# Altium schematic sheet Sheet1.SchDoc
size A4
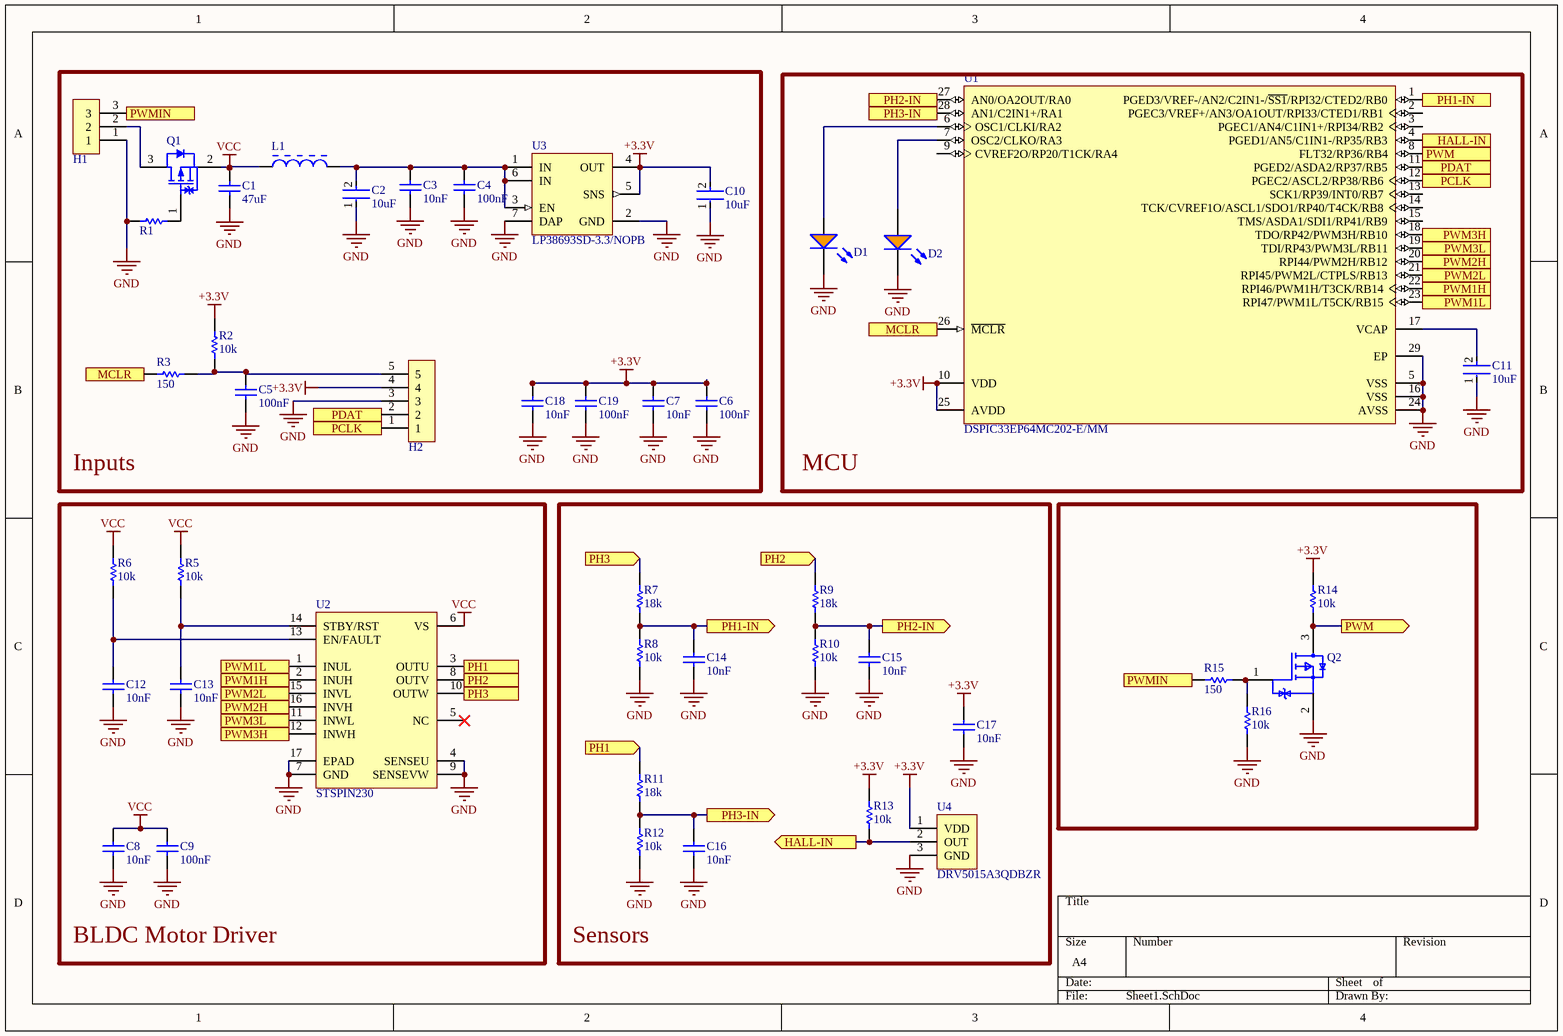
[diagram p0: Sheet1.SchDoc]

## Parts
C1  47uF  [TAYO-C1210-2_L]
C2  10uF  [FP-CL21B106KOQNNNE-MFG]
C3  10nF  [CAPC1005X56X25ML10T15]
C4  100nF  [CAPC1005X56X25ML10T15]
C5  100nF  [CAPC1005X56X25ML10T15]
C6  100nF  [CAPC1005X56X25ML10T15]
C7  10nF  [CAPC1005X56X25ML10T15]
C8  10nF  [CAPC1005X56X25ML10T15]
C9  100nF  [CAPC1005X56X25ML10T15]
C10  10uF  [FP-CL21B106KOQNNNE-MFG]
C11  10uF  [FP-CL21B106KOQNNNE-MFG]
C12  10nF  [CAPC1005X56X25ML10T15]
C13  10nF  [CAPC1005X56X25ML10T15]
C14  10nF  [CAPC1005X56X25ML10T15]
C15  10nF  [CAPC1005X56X25ML10T15]
C16  10nF  [CAPC1005X56X25ML10T15]
C17  10nF  [CAPC1005X56X25ML10T15]
C18  10nF  [CAPC1005X56X25ML10T15]
C19  100nF  [CAPC1005X56X25ML10T15]
D1  HSMD-C190  [AVAG-HSMX-C190_V]  (value not drawn)
D2  HSMD-C190  [AVAG-HSMX-C190_V]  (value not drawn)
H1  H3P2.54  [H3P2.54]  (value not drawn)
H2  H5P2.54  [H5P2.54*]  (value not drawn)
L1  BLM18AG331SN1D  [MURA-BLM18-RF-H4-CHIP-2_V]  (value not drawn)
Q1  BSS308PE  [INF-PG-SOT23_L]  (value not drawn)
Q2  DMG1013T-7  [FP-SOT523-IPC_B]  (value not drawn)
R1  RC0402FR-07150RL  [RESC1005X40X25ML05T10]  (value not drawn)
R2  10k  [RESC1005X40X25ML5T10]
R3  150  [RESC1005X40X25ML05T10]
R5  10k  [RESC1005X40X25ML5T10]
R6  10k  [RESC1005X40X25ML5T10]
R7  18k  [RESC1005X40X25ML05T10]
R8  10k  [RESC1005X40X25ML5T10]
R9  18k  [RESC1005X40X25ML05T10]
R10  10k  [RESC1005X40X25ML5T10]
R11  18k  [RESC1005X40X25ML05T10]
R12  10k  [RESC1005X40X25ML5T10]
R13  10k  [RESC1005X40X25ML5T10]
R14  10k  [RESC1005X40X25ML5T10]
R15  150  [RESC1005X40X25ML05T10]
R16  10k  [RESC1005X40X25ML5T10]
U1  DSPIC33EP64MC202-E/MM  [MCHP-QFN-S-MM28_N]
U2  STSPIN230  [QFN50P300X300X100_HS-17N]
U3  LP38693SD-3.3/NOPB  [NGG0006A_V]
U4  DRV5015A3QDBZR  [SOT95P237X95-3N]

## Blocks framed on the sheet
Inputs: C1-C7 C10 C18 C19 H1 H2 L1 Q1 R1-R3 U3
MCU: C11 D1 D2 U1
BLDC Motor Driver: C8 C9 C12 C13 R5 R6 U2
Sensors: C14-C17 R7-R13 U4

## Ports
HALL-IN (in), HALL-IN (out), MCLR (in), MCLR (out), PCLK (out), PDAT (out), PH1 (in), PH1 (out), PH1-IN (in), PH1-IN (out), PH2 (in), PH2 (out), PH2-IN (in), PH2-IN (out), PH3 (in), PH3 (out), PH3-IN (in), PH3-IN (out), PWM1H (in), PWM1H (out), PWM1L (in), PWM1L (out), PWM2H (in), PWM2H (out), PWM2L (in), PWM2L (out), PWM3H (in), PWM3H (out), PWM3L (in), PWM3L (out), PWM (in), PWM (out), PWMIN (out)

## Nets
+3.3V: C6.2 C7.2 C10.2 C17.2 C18.2 C19.2 H2.4 R2.2 R13.2 R14.1 U1.10(VDD) U1.25(AVDD) U3.4(OUT) U3.5(SNS) U4.1(VDD)
GND: C1.1 C2.1 C3.1 C4.1 C5.1 C6.1 C7.1 C8.1 C9.1 C10.1 C11.1 C12.1 C13.1 C14.1 C15.1 C16.1 C17.1 C18.1 C19.1 D1.2(K) D2.2(K) H1.1 H2.3 Q2.2(S) R1.2 R8.1 R10.1 R12.1 R16.1 U1.5(VSS) U1.16(VSS) U1.24(AVSS) U1.29(EP) U2.4(SENSEU) U2.7(GND) U2.9(SENSEVW) U2.17(EPAD) U3.2(GND) U3.7(DAP) U4.3(GND)
VCC: C1.2 C8.2 C9.2 L1.1 Q1.2(SOURCE) R5.2 R6.2 U2.6(VS)
HALL-IN: R13.1 U1.4(PGED1/AN5/C1IN1-/RP35/RB3) U4.2(OUT) ; port HALL-IN
MCLR: R3.1 U1.26(~{MCLR}) ; port MCLR
PCLK: H2.1 U1.12(PGEC2/ASCL2/RP38/RB6) ; port PCLK
PDAT: H2.2 U1.11(PGED2/ASDA2/RP37/RB5) ; port PDAT
PH1: R11.2 U2.3(OUTU) ; port PH1
PH1-IN: C14.2 R7.1 R8.2 U1.1(PGED3/VREF-/AN2/C2IN1-/~{SS1}/RPI32/CTED2/RB0) ; port PH1-IN
PH2: R9.2 U2.8(OUTV) ; port PH2
PH2-IN: C15.2 R9.1 R10.2 U1.27(AN0/OA2OUT/RA0) ; port PH2-IN
PH3: R7.2 U2.10(OUTW) ; port PH3
PH3-IN: C16.2 R11.1 R12.2 U1.28(AN1/C2IN1+/RA1) ; port PH3-IN
PWM: Q2.3(D) R14.2 U1.8(FLT32/RP36/RB4) ; port PWM
PWM1H: U1.22(RPI46/PWM1H/T3CK/RB14) U2.2(INUH) ; port PWM1H
PWM1L: U1.23(RPI47/PWM1L/T5CK/RB15) U2.1(INUL) ; port PWM1L
PWM2H: U1.20(RPI44/PWM2H/RB12) U2.16(INVH) ; port PWM2H
PWM2L: U1.21(RPI45/PWM2L/CTPLS/RB13) U2.15(INVL) ; port PWM2L
PWM3H: U1.18(TDO/RP42/PWM3H/RB10) U2.12(INWH) ; port PWM3H
PWM3L: U1.19(TDI/RP43/PWM3L/RB11) U2.11(INWL) ; port PWM3L
PWMIN: H1.3 R15.1 ; port PWMIN
NetC2_2: C2.2 C3.2 C4.2 L1.2 U3.1(IN) U3.3(EN) U3.6(IN)
NetC5_2: C5.2 H2.5 R2.1 R3.2
NetC11_2: C11.2 U1.17(VCAP)
NetC12_2: C12.2 R6.1 U2.13(EN/FAULT)
NetC13_2: C13.2 R5.1 U2.14(STBY/RST)
NetD1_1: D1.1(A) U1.6(OSC1/CLKI/RA2)
NetD2_1: D2.1(A) U1.7(OSC2/CLKO/RA3)
NetH1_2: H1.2 Q1.3(DRAIN)
NetQ1_1: Q1.1(GATE) R1.1
NetQ2_1: Q2.1(G) R15.2 R16.2

Not connected (* = marked no-connect by the designer): U1 2(PGEC3/VREF+/AN3/OA1OUT/RPI33/CTED1/RB1) 3(PGEC1/AN4/C1IN1+/RPI34/RB2) 9(CVREF2O/RP20/T1CK/RA4) 13(SCK1/RP39/INT0/RB7) 14(TCK/CVREF1O/ASCL1/SDO1/RP40/T4CK/RB8) 15(TMS/ASDA1/SDI1/RP41/RB9); U2 5(NC)*

## Library data of the parts
C1 = CMP-2000-06559-1: High Value Multilayer Ceramic Capacitor, 47 uF, 10 V, +/- 20%, -55 to 125 degC, 2-Pin - LMK325B7476KM-PRSMD (C1210), RoHS, Tape and Reel; Manufacturer: Taiyo Yuden; Capacitance: 47µF; Voltage - Rated: 10V; Other Names: 587-2783-6; Online Catalog: MSeries; Temperature Coefficient: X7R; Applications: GeneralPurpose; Lead Spacing: -; Mounting Technology: SurfaceMount; Height - Seated (Max): -; Thickness (Max): 0.106"(2.70mm); Mounting Type: SurfaceMount,MLCC; Package / Case: 1210(3225Metric); Lead Style: -; Manufacturer URL: http://www.t-yuden.com/; Size / Dimension: 0.126"Lx0.098"W(3.20mmx2.50mm); Datasheet Version: 10/2014; Packaging: Digi-Reel®; Category: Capacitors; Datasheet URL: https://datasheet.ciiva.com/142/lmk325b7476mm-tr-ss-142765.pdf; Tolerance: ±20%; Features: -; Package Reference: C1210; Package Description: 2-Pin Surface Mount Device, Body 3.2 x 2.5 mm, Height 2.7 mm; Series: M; Family: CeramicCapacitors; Operating Temperature: -55°C~125°C; Standard Package: 1; Ratings: -
C2 C10 C11 = CMP-2000-06106-2: CAP CER 10UF 16V X7R 0805 - CL21B106KOQNNNE; Manufacturer: Samsung Electro-Mechanics America, Inc; Material: Ceramic; Tolerance: 10%; Temperature Coefficient: 15%; Digikey Description: CAP CER 10UF 16V X7R 0805; Lead Free: Yes; ComponentLink2URL: http://www.samsungsem.com/servlet/FileDownload?path=productsearch&sname=CL21B106KOQNNNE.pdf&oname=CL21B106KOQNNNE.pdf; ComponentLink2Description: Datasheet; Temperature Range Low: -55°C; RoHS: TRUE; Category: Cap; Temperature Characteristic: X7R; Manufacturer Part Number: CL21B106KOQNNNE; Automotive: No; Octopart: https://octopart.com/cl21b106koqnnne-samsung-19832289; Device Class L3: Ceramic Capacitors; Temperature Range High: +125°C; Height: 1.4mm; Device Class L2: Capacitors; Voltage Rating: 16V; Value: 10uF; Temperature: -55°C to +125°C; Device Class L1: Passive Components; Ipc Land Pattern Name: CAPC200125X125; Package: CL21B106KOQNNNE; Capacitance: 10uF
C3 C7 C8 C12-C18 = CMP-2008-02799-1: 0402YC103MAT2A; Manufacturer: AVX Interconnect / Elco; Part Number: 0402YC103MAT2A
C4 C5 C9 = CMP-2008-02800-1: 0402YC104KAT2A; Manufacturer: AVX Interconnect / Elco; Part Number: 0402YC104KAT2A
C6 C19 = CMP-2008-02800-1: 100nF / 0402YC104KAT2A; Manufacturer: AVX Interconnect / Elco; Part Number: 0402YC104KAT2A
D1 D2 = CMP-007-00012-1: LED Uni-Color Orange, 52 mW, 20 mA, -40 to 85 degC, 2-Pin SMD, RoHS, Tape and Reel; Manufacturer: Avago; Luminous Intensity: 8mcd; Power: 52mW; Nominal Vf: 2.2V; Viewing Angle: 170degrees; Forward Current: 20mA; Lens Style: Diffused; Packaging: TapeandReel; Package Reference: HSMX-C190; Package Quantity: 4000; Colour: Orange; Datasheet URL: http://docs.avagotech.com/docs/AV02-0551EN; Pins: 2; Package Description: 2-Pin Surface Mount Device, Body 1.6 x 0.8 mm, Height 0.9 mm; Datasheet Version: Mar-12; RoHS Compliant: True; Min Operating Temperature: -40°C; Case/Package: 0603; Manufacturer URL: http://www.avagotech.com/; Max Operating Temperature: 85°C; Mounting Technology: SM; Illumination Colour: Orange; Forward Voltage: 2.2V
L1 = CMP-0686-00430-2: Chip Ferrite Bead for General Use, 330 Ohm, 500 mA, -55 to 125 degC, 1.6 x 0.8 x 0.95 mm SMD, Tape and Reel; Manufacturer: Murata; Impedance (at 100 MHz): 330 Ohm +/- 25%; Rated Current: 500 mA; DC Resistance: 0.30 Ohm Max.; PartNumber: BLM18AG331SN1D; ComponentLink3Description: Package Specification; PackageReference: BLM18_H950-2; DatasheetVersion: 08/2013; ComponentLink1URL: http://www.murata.com/; ComponentLink2Description: Datasheet; Mounting Technology: Surface Mount; Operating Temperature Range: -55 to 125 degC; Packing: Tape and Reel; ComponentLink1Description: Manufacturer URL; ComponentLink3URL: http://www.murata.com/products/catalog/pdf/c31e.pdf; PackageDescription: 2-Pin Chip, Body 1.6 x 0.8 mm; ComponentLink2URL: http://www.murata.com/products/catalog/pdf/c31e.pdf
Q1 = CMP-1099-00030-1: P-Channel OptiMOS P3 Small-Signal-Transistor, -30 V VDS, -2 A ID, -55 to 150 degC, PG-SOT23, Reel, Green; Manufacturer: Infineon; RDS (on) (max) (@4.5V): 130Â mOhm; Pto t (max): 0.5Â W; ID (max): -2Â A; IDpuls (max): -8Â A; VDS (max): -30Â V; VGS(th) (min): -2Â V; Green: TRUE; RDS (on) (max): 80Â mOhm; QG: -5Â nC; Rth: 250Â K/W; VGS(th) (max): -1Â V; PartNumber: BSS308PE; ComponentLink3Description: Package Specification; PackageDescription: 3-Pin Small Outline Transistor Package, 2.9 x 1.3 mm Body, 0.95 mm Pitch; Mounting Technology: Surface Mount; Packing: Reel; PackageReference: PG-SOT23; PackageVersion: Apr-08; Halogen-free: TRUE; DatasheetVersion: Rev. 2.03; ComponentLink2URL: http://www.infineon.com/dgdl/BSS308PE_Rev23_.pdf?folderId=db3a304314dca38901154a72e3951a65&fileId=db3a304330f686060131099c80400073; ComponentLink2Description: Datasheet; ComponentLink1Description: Manufacturer URL; ComponentLink1URL: http://www.infineon.com/; ComponentLink3URL: http://www.infineon.com/dgdl/SOT23-Package_Overview.pdf?folderId=db3a30431936bc4b0119532290053c66&fileId=db3a30431936bc4b0119533468123c85
Q2 = CMP-12801-000011-2: MOSFET P-CH 20V 0.46A SOT-523; Threshold Voltage: -1V; Continuous Drain Current (ID): 460mA; Rise Time: 8.1ns; Turn-Off Delay Time: 28.4ns; Number of Channels: 1; On-State Resistance: 700mR; Power Dissipation: 270mW; Input Capacitance: 59.76pF; Fall Time: 20.7ns; Turn-On Delay Time: 5.1ns; Drain to Source Resistance: 1R; Drain to Source Breakdown Voltage: -20V; Gate to Source Voltage (Vgs): 6V; Element Configuration: Single; Min Operating Temperature: -55°C; Max Operating Temperature: 150°C; Case/Package: SOT-523; Lead Free: Lead Free; Length: 1.7mm; REACH SVHC: No SVHC; Radiation Hardening: No; Number of Pins: 3; Weight: 7.1E-05oz; Rds On Max: 700mR; Height: 0.8mm; Number of Elements: 1; Packaging: Tape and Reel; Mount: Surface Mount; Width: 0.85mm; Drain to Source Voltage (Vdss): 20V; Max Power Dissipation: 270mW; Contact Plating: Tin; Package Quantity: 1
R1 = CMP-2002-07401-1: Manufacturer: Yageo / Phycomp; Part Number: RC0402FR-07150RL
R2 R5 R6 R8 R10 R12-R14 R16 = CMP-2002-07915-2: Chip Resistor, 10 KOhm, +/- 5%, 0.063 W, -55 to 155 degC, 0402 (1005 Metric), RoHS, Tape and Reel - RC0402JR-0710KL; Resistance: 10 kohm; Voltage Rating (DC): 50 V; Power Rating: 63 mW; Case\Package: 0402; RoHSCompliant: true; DatasheetVersion: Rev. 4, 02/2016; ComponentLink1Description: Manufacturer URL; PackageDescription: 2-Pin Surface Mount Device, Body 1 x 0.5 mm; Case Code (Imperial): 0402; PackageReference: 0402; ComponentLink1URL: http://www.yageo.com/; Mounting Technology: Surface Mount; REACH SVHC: No SVHC; ComponentLink2Description: Datasheet; Case Code (Metric): 1005; Width: 0.5 mm; Package Quantity: 10000; Packaging: Tape and Reel; Max Operating Temperature: 155 degC; Mount: Surface Mount; Length: 1 mm; ComponentLink2URL: http://www.yageo.com/documents/recent/PYu-RC_Group_51_RoHS_L_04.pdf; Tolerance: 5%; Height: 0.35 mm; Voltage Rating: 50 V; Pins: 2; Min Operating Temperature: -55 degC
R3 R15 = CMP-2002-07401-1: RC0402FR-07150RL; Manufacturer: Yageo / Phycomp; Part Number: RC0402FR-07150RL
R7 R9 R11 = CMP-2002-07934-1: RC0402JR-0718KL; Manufacturer: Yageo / Phycomp; Part Number: RC0402JR-0718KL
U1 = CMP-0375-00039-1: 16-Bit Microcontroller and Digital Signal Controller with High-Speed PWM, Op Amps and Advanced Analog, 70 MIPS, 21 I/O, GPIO, -40 to 125 degC, 28-pin QFN (MM28), Tube; Manufacturer: Microchip; PackageReference: QFN-MM28; ComponentLink3Description: Package Specification; ComponentLink4Description: Product URL; ComponentLink3URL: http://www.microchip.com/stellent/groups/techpub_sg/documents/packagingspec/en012702.pdf; PackageVersion: C04-124C; PartNumber: DSPIC33EP64MC202-E/MM; ComponentLink4URL: http://www.microchip.com/dsPIC33EP64MC202; DatasheetVersion: Rev. F; ComponentLink2URL: http://ww1.microchip.com/downloads/en/DeviceDoc/70657F.pdf; Mounting Technology: Surface Mount; ComponentLink1Description: Manufacturer URL; ComponentLink2Description: Datasheet; ComponentLink1URL: http://www.microchip.com; PackageDescription: 28-Lead Plastic Quad Flat, 6 x 6 mm Body, 0.65 mm Pitch
U3 = CMP-0062-01530-4: 500mA Low Dropout CMOS Linear Regulators Stable with Ceramic Output Capacitors, 6-pin LLP, Pb-Free, 1000 Reel; Manufacturer: Texas Instruments; High-Reliability: Y; CompType: LDO IC; PackageTopMarking: ZXYTT*L130B; PackageReference: NGG0006A; PinCount: 6; RoHS: Y; ComponentLink1URL: http://www.ti.com/general/docs/lit/getliterature.tsp?genericPartNumber=LP38693&fileType=pdf; PowerWise: Y; PackageDescription: LLP, Plastic, Dual, 3 x 3 x 0.8mm Body, 6 Lead, 0.95mm Pitch, No Pullback; PartNumber: LP38693SD-3.3/NOPB; ComponentLink1Description: Datasheet URL